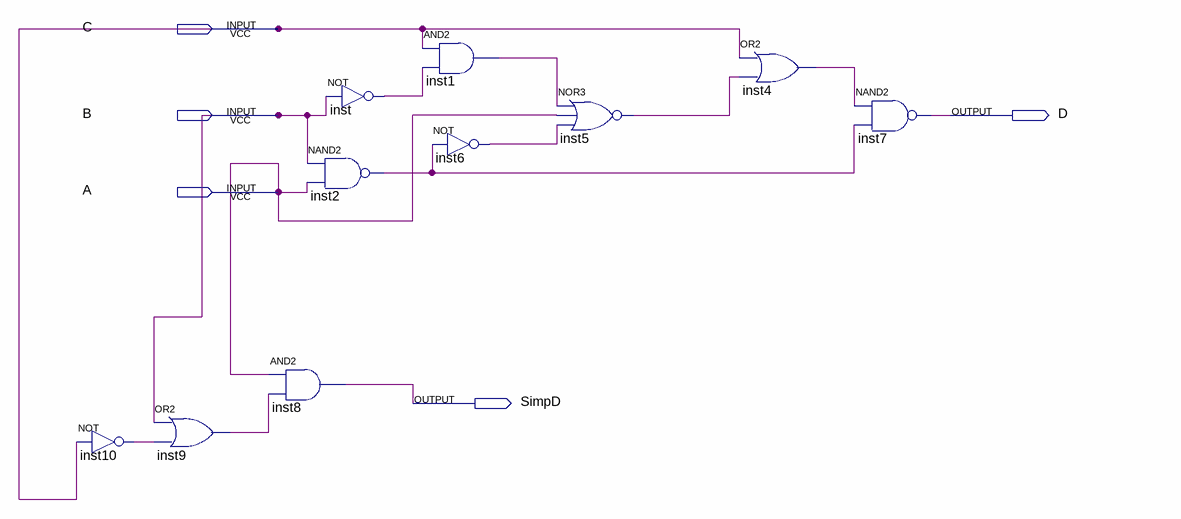
[diagram p0: schematic sheet]
// Quartus schematic Lab2_SectionB.bdf as structural Verilog: 10 symbols, 5 pins
module Lab2_SectionB (
  input  C,
  input  B,
  input  A,
  output D,
  output SimpD
);

  wire inst1_out, inst2_out, inst4_out, inst5_out, inst6_out, inst9_out, inst10_out, inst_out;

  not inst10 (inst10_out, C);
  or inst9 (inst9_out, B, inst10_out);
  not inst (inst_out, B);
  nand inst2 (inst2_out, B, A);
  and inst8 (SimpD, A, inst9_out);
  and inst1 (inst1_out, C, inst_out);
  not inst6 (inst6_out, inst2_out);
  nor inst5 (inst5_out, inst1_out, A, inst6_out);
  or inst4 (inst4_out, C, inst5_out);
  nand inst7 (D, inst4_out, inst2_out);
endmodule
